# EAGLE schematic Main BoardV4 (EAGLE 9.1.3)
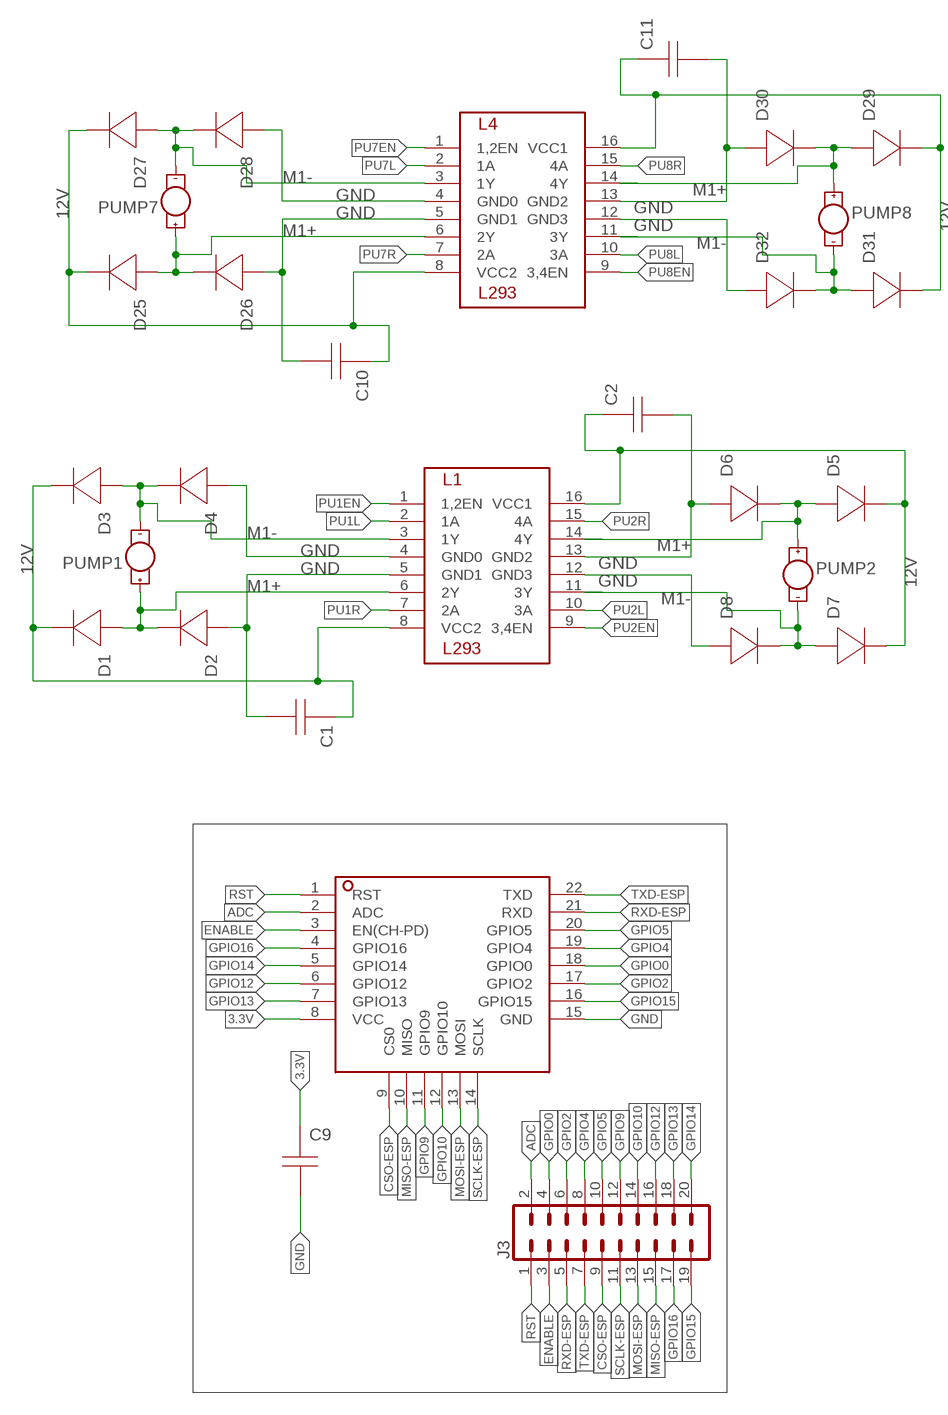
[diagram p0: schematic, sheet 1, part 1 of 2]
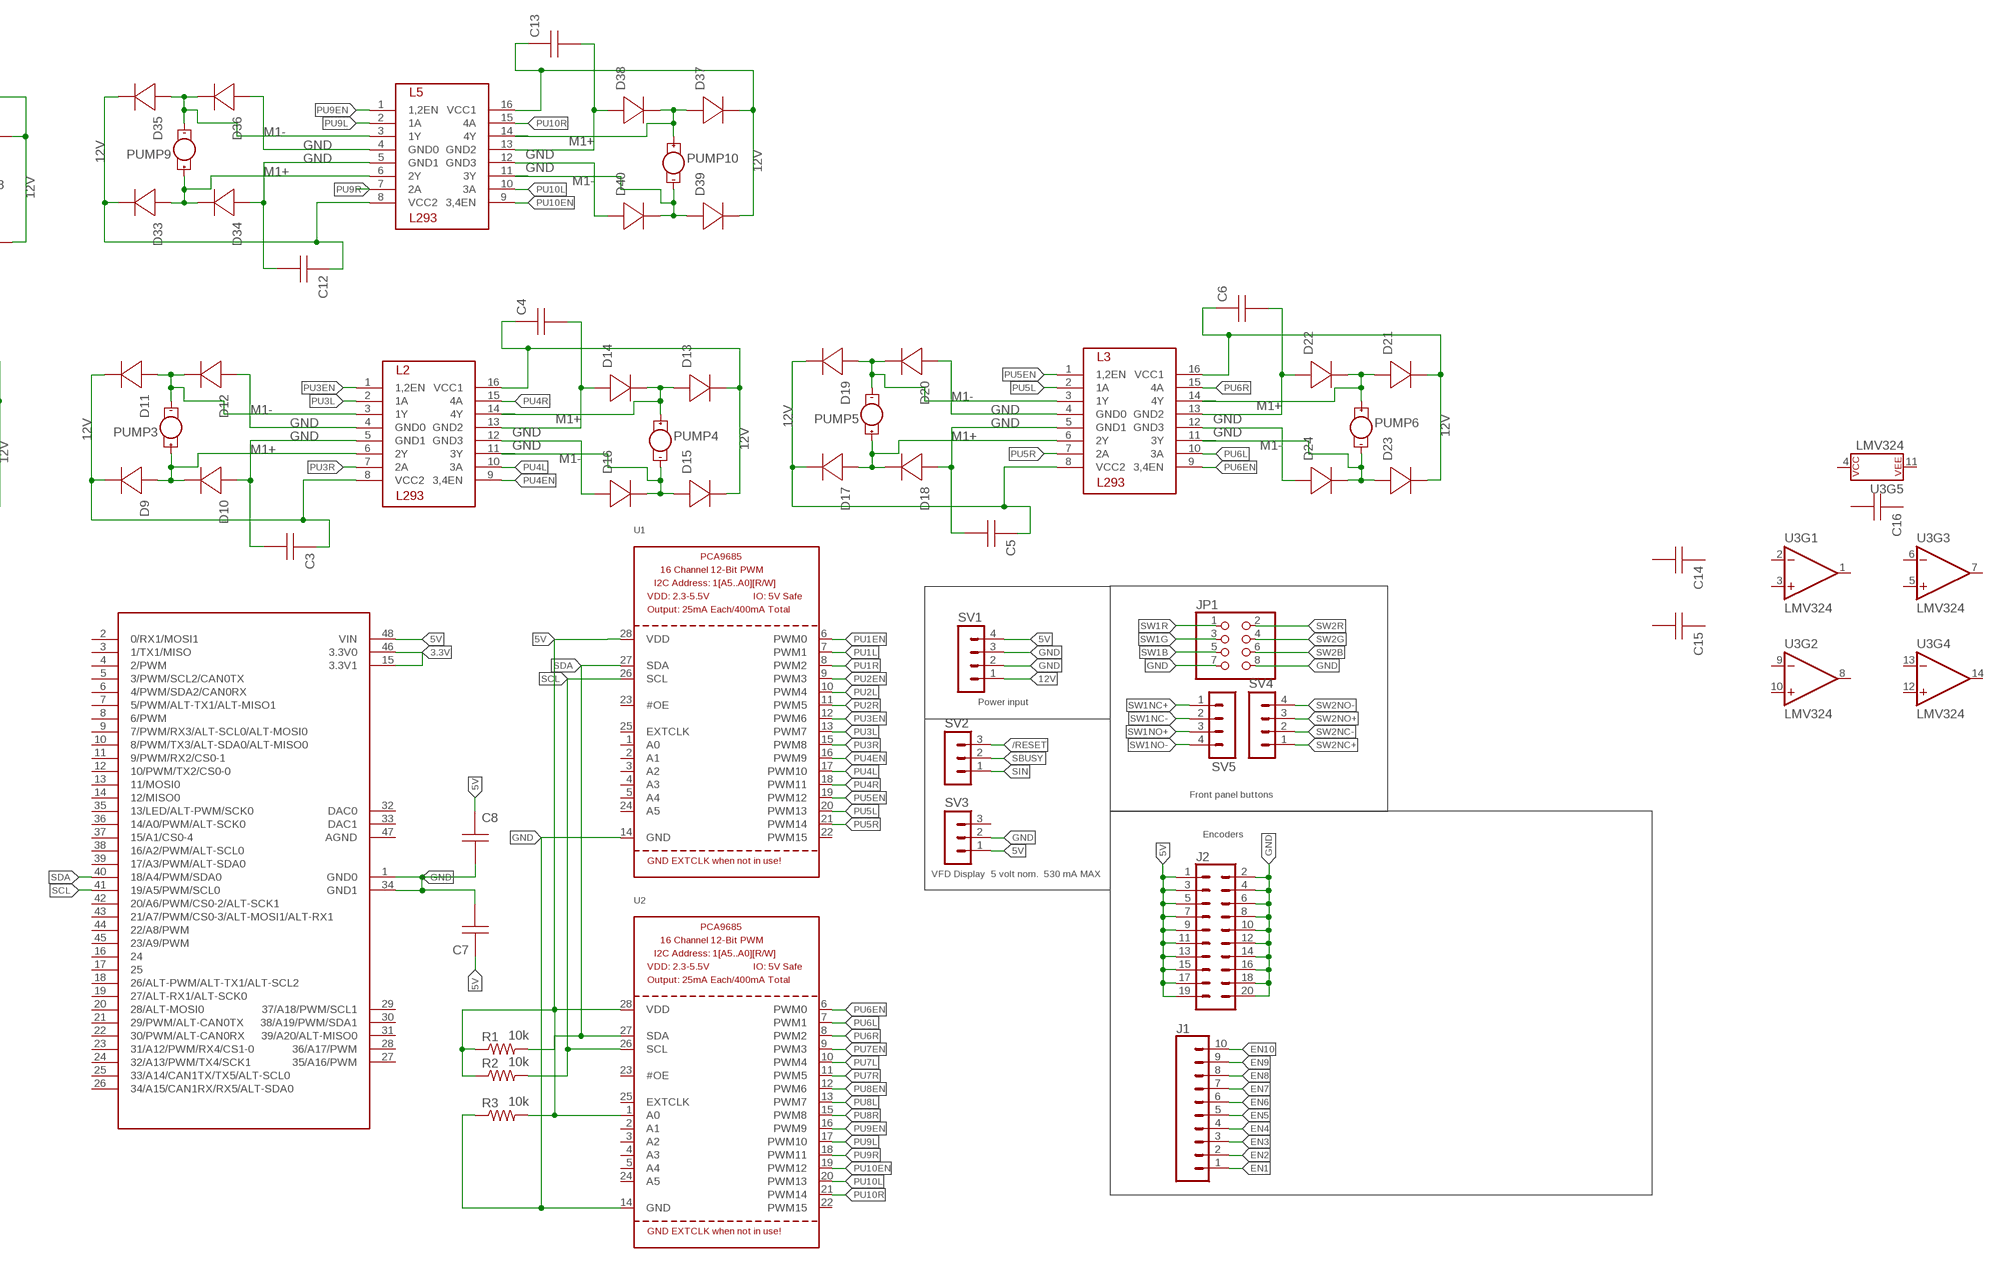
[diagram p1: schematic, sheet 1, part 2 of 2]

## Parts
C1  CAP  [C0805]
C2  CAP  [C0805]
C3  CAP  [C0805]
C4  CAP  [C0805]
C5  CAP  [C0805]
C6  CAP  [C0805]
C7  CAP  [C0805]
C8  CAP  [C0805]
C9  CAP  [C0805]
C10  CAP  [C0805]
C11  CAP  [C0805]
C12  CAP  [C0805]
C13  CAP  [C0805]
C14  CAP  [C0805]
C15  CAP  [C0805]
C16  CAP  [C0805]
D1  UPR5E3-DIODE  [DIOC4519X114]
D2  UPR5E3-DIODE  [DIOC4519X114]
D3  UPR5E3-DIODE  [DIOC4519X114]
D4  UPR5E3-DIODE  [DIOC4519X114]
D5  UPR5E3-DIODE  [DIOC4519X114]
D6  UPR5E3-DIODE  [DIOC4519X114]
D7  UPR5E3-DIODE  [DIOC4519X114]
D8  UPR5E3-DIODE  [DIOC4519X114]
D9  UPR5E3-DIODE  [DIOC4519X114]
D10  UPR5E3-DIODE  [DIOC4519X114]
D11  UPR5E3-DIODE  [DIOC4519X114]
D12  UPR5E3-DIODE  [DIOC4519X114]
D13  UPR5E3-DIODE  [DIOC4519X114]
D14  UPR5E3-DIODE  [DIOC4519X114]
D15  UPR5E3-DIODE  [DIOC4519X114]
D16  UPR5E3-DIODE  [DIOC4519X114]
D17  UPR5E3-DIODE  [DIOC4519X114]
D18  UPR5E3-DIODE  [DIOC4519X114]
D19  UPR5E3-DIODE  [DIOC4519X114]
D20  UPR5E3-DIODE  [DIOC4519X114]
D21  UPR5E3-DIODE  [DIOC4519X114]
D22  UPR5E3-DIODE  [DIOC4519X114]
D23  UPR5E3-DIODE  [DIOC4519X114]
D24  UPR5E3-DIODE  [DIOC4519X114]
D25  UPR5E3-DIODE  [DIOC4519X114]
D26  UPR5E3-DIODE  [DIOC4519X114]
D27  UPR5E3-DIODE  [DIOC4519X114]
D28  UPR5E3-DIODE  [DIOC4519X114]
D29  UPR5E3-DIODE  [DIOC4519X114]
D30  UPR5E3-DIODE  [DIOC4519X114]
D31  UPR5E3-DIODE  [DIOC4519X114]
D32  UPR5E3-DIODE  [DIOC4519X114]
D33  UPR5E3-DIODE  [DIOC4519X114]
D34  UPR5E3-DIODE  [DIOC4519X114]
D35  UPR5E3-DIODE  [DIOC4519X114]
D36  UPR5E3-DIODE  [DIOC4519X114]
D37  UPR5E3-DIODE  [DIOC4519X114]
D38  UPR5E3-DIODE  [DIOC4519X114]
D39  UPR5E3-DIODE  [DIOC4519X114]
D40  UPR5E3-DIODE  [DIOC4519X114]
ESP1  ESP8266  [ESP8266MOD]
J1  CONN_10NO_SILK_PTH_FEMALE  [1X10_NO_SILK]
J2  CONN_10X2NOSILK  [2X10_NOSILK]
J3  CONN_10X22X10_LOCK  [2X10_LOCK]
JP1  PINHD-2X4  [2X04]
L1  L293  [DIP762W53P254L1969H508Q16B]
L2  L293  [DIP762W53P254L1969H508Q16B]
L3  L293  [DIP762W53P254L1969H508Q16B]
L4  L293  [DIP762W53P254L1969H508Q16B]
L5  L293  [DIP762W53P254L1969H508Q16B]
PUMP1  PUMPS  [1X2_HEADER]
PUMP2  PUMPS  [1X2_HEADER]
PUMP3  PUMPS  [1X2_HEADER]
PUMP4  PUMPS  [1X2_HEADER]
PUMP5  PUMPS  [1X2_HEADER]
PUMP6  PUMPS  [1X2_HEADER]
PUMP7  PUMPS  [1X2_HEADER]
PUMP8  PUMPS  [1X2_HEADER]
PUMP9  PUMPS  [1X2_HEADER]
PUMP10  PUMPS  [1X2_HEADER]
R1  10k  R-US_R0402  [R0402]
R2  10k  R-US_R0402  [R0402]
R3  10k  R-US_R0402  [R0402]
SV1  MA04-1  [MA04-1]
SV2  MA03-1  [MA03-1]
SV3  MA03-1  [MA03-1]
SV4  MA04-1  [MA04-1]
SV5  MA04-1  [MA04-1]
TEENSY1  TEENSY_3.5  [DIP1524W60P254L6350H635Q48A]
U1  PCA9685  [TSSOP28]
U2  PCA9685  [TSSOP28]
U3  LMV324  [SO14]

## Nets
3.3V: C9.1(A) ESP1.8(VCC) TEENSY1.15(3.3V1) TEENSY1.46(3.3V0)
5V: C7.1(A) C8.1(A) J2.1 J2.3 J2.5 J2.7 J2.9 J2.11 J2.13 J2.15 J2.17 J2.19 R1.1 R2.1 R3.2 SV1.4 SV3.1 TEENSY1.48(VIN) U1.28(VDD) U2.1(A0) U2.28(VDD)
12V: C1.1(A) C2.1(A) C3.1(A) C4.1(A) C5.1(A) C6.1(A) C10.1(A) C11.1(A) C12.1(A) C13.1(A) D1.1(-) D3.1(-) D5.1(-) D7.1(-) D9.1(-) D11.1(-) D13.1(-) D15.1(-) D17.1(-) D19.1(-) D21.1(-) D23.1(-) D25.1(-) D27.1(-) D29.1(-) D31.1(-) D33.1(-) D35.1(-) D37.1(-) D39.1(-) L1.8(VCC2) L1.16(VCC1) L2.8(VCC2) L2.16(VCC1) L3.8(VCC2) L3.16(VCC1) L4.8(VCC2) L4.16(VCC1) L5.8(VCC2) L5.16(VCC1) SV1.1
/RESET: SV2.3
ADC: ESP1.2(ADC) J3.2
CSO-ESP: ESP1.9(CS0) J3.9
EN1: J1.1
EN2: J1.2
EN3: J1.3
EN4: J1.4
EN5: J1.5
EN6: J1.6
EN7: J1.7
EN8: J1.8
EN9: J1.9
EN10: J1.10
ENABLE: ESP1.3(EN(CH-PD)) J3.3
GND: C1.2(B) C2.2(B) C3.2(B) C4.2(B) C5.2(B) C6.2(B) C7.2(B) C8.2(B) C9.2(B) C10.2(B) C11.2(B) C12.2(B) C13.2(B) D2.2(+) D4.2(+) D6.2(+) D8.2(+) D10.2(+) D12.2(+) D14.2(+) D16.2(+) D18.2(+) D20.2(+) D22.2(+) D24.2(+) D26.2(+) D28.2(+) D30.2(+) D32.2(+) D34.2(+) D36.2(+) D38.2(+) D40.2(+) ESP1.15(GND) J2.2 J2.4 J2.6 J2.8 J2.10 J2.12 J2.14 J2.16 J2.18 J2.20 JP1.7 JP1.8 L1.4(GND0) L1.5(GND1) L1.12(GND3) L1.13(GND2) L2.4(GND0) L2.5(GND1) L2.12(GND3) L2.13(GND2) L3.4(GND0) L3.5(GND1) L3.12(GND3) L3.13(GND2) L4.4(GND0) L4.5(GND1) L4.12(GND3) L4.13(GND2) L5.4(GND0) L5.5(GND1) L5.12(GND3) L5.13(GND2) R3.1 SV1.2 SV1.3 SV3.2 TEENSY1.1(GND0) TEENSY1.34(GND1) U1.14(GND) U2.14(GND)
GPIO0: ESP1.18(GPIO0) J3.4
GPIO2: ESP1.17(GPIO2) J3.6
GPIO4: ESP1.19(GPIO4) J3.8
GPIO5: ESP1.20(GPIO5) J3.10
GPIO9: ESP1.11(GPIO9) J3.12
GPIO10: ESP1.12(GPIO10) J3.14
GPIO12: ESP1.6(GPIO12) J3.16
GPIO13: ESP1.7(GPIO13) J3.18
GPIO14: ESP1.5(GPIO14) J3.20
GPIO15: ESP1.16(GPIO15) J3.19
GPIO16: ESP1.4(GPIO16) J3.17
M1+: D1.2(+) D2.1(-) D5.2(+) D6.1(-) D9.2(+) D10.1(-) D13.2(+) D14.1(-) D17.2(+) D18.1(-) D21.2(+) D22.1(-) D25.2(+) D26.1(-) D29.2(+) D30.1(-) D33.2(+) D34.1(-) D37.2(+) D38.1(-) L1.6(2Y) L1.14(4Y) L2.6(2Y) L2.14(4Y) L3.6(2Y) L3.14(4Y) L4.6(2Y) L4.14(4Y) L5.6(2Y) L5.14(4Y) PUMP1.1(+) PUMP2.1(+) PUMP3.1(+) PUMP4.1(+) PUMP5.1(+) PUMP6.1(+) PUMP7.1(+) PUMP8.1(+) PUMP9.1(+) PUMP10.1(+)
M1-: D3.2(+) D4.1(-) D7.2(+) D8.1(-) D11.2(+) D12.1(-) D15.2(+) D16.1(-) D19.2(+) D20.1(-) D23.2(+) D24.1(-) D27.2(+) D28.1(-) D31.2(+) D32.1(-) D35.2(+) D36.1(-) D39.2(+) D40.1(-) L1.3(1Y) L1.11(3Y) L2.3(1Y) L2.11(3Y) L3.3(1Y) L3.11(3Y) L4.3(1Y) L4.11(3Y) L5.3(1Y) L5.11(3Y) PUMP1.2(-) PUMP2.2(-) PUMP3.2(-) PUMP4.2(-) PUMP5.2(-) PUMP6.2(-) PUMP7.2(-) PUMP8.2(-) PUMP9.2(-) PUMP10.2(-)
MISO-ESP: ESP1.10(MISO) J3.15
MOSI-ESP: ESP1.13(MOSI) J3.13
PU1EN: L1.1(1,2EN) U1.6(PWM0)
PU1L: L1.2(1A) U1.7(PWM1)
PU1R: L1.7(2A) U1.8(PWM2)
PU2EN: L1.9(3,4EN) U1.9(PWM3)
PU2L: L1.10(3A) U1.10(PWM4)
PU2R: L1.15(4A) U1.11(PWM5)
PU3EN: L2.1(1,2EN) U1.12(PWM6)
PU3L: L2.2(1A) U1.13(PWM7)
PU3R: L2.7(2A) U1.15(PWM8)
PU4EN: L2.9(3,4EN) U1.16(PWM9)
PU4L: L2.10(3A) U1.17(PWM10)
PU4R: L2.15(4A) U1.18(PWM11)
PU5EN: L3.1(1,2EN) U1.19(PWM12)
PU5L: L3.2(1A) U1.20(PWM13)
PU5R: L3.7(2A) U1.21(PWM14)
PU6EN: L3.9(3,4EN) U2.6(PWM0)
PU6L: L3.10(3A) U2.7(PWM1)
PU6R: L3.15(4A) U2.8(PWM2)
PU7EN: L4.1(1,2EN) U2.9(PWM3)
PU7L: L4.2(1A) U2.10(PWM4)
PU7R: L4.7(2A) U2.11(PWM5)
PU8EN: L4.9(3,4EN) U2.12(PWM6)
PU8L: L4.10(3A) U2.13(PWM7)
PU8R: L4.15(4A) U2.15(PWM8)
PU9EN: L5.1(1,2EN) U2.16(PWM9)
PU9L: L5.2(1A) U2.17(PWM10)
PU9R: L5.7(2A) U2.18(PWM11)
PU10EN: L5.9(3,4EN) U2.19(PWM12)
PU10L: L5.10(3A) U2.20(PWM13)
PU10R: L5.15(4A) U2.21(PWM14)
RST: ESP1.1(RST) J3.1
RXD-ESP: ESP1.21(RXD) J3.5
SBUSY: SV2.2
SCL: R2.2 TEENSY1.41(19/A5/PWM/SCL0) U1.26(SCL) U2.26(SCL)
SCLK-ESP: ESP1.14(SCLK) J3.11
SDA: R1.2 TEENSY1.40(18/A4/PWM/SDA0) U1.27(SDA) U2.27(SDA)
SIN: SV2.1
SW1B: JP1.5
SW1G: JP1.3
SW1NC+: SV5.1
SW1NC-: SV5.2
SW1NO+: SV5.3
SW1NO-: SV5.4
SW1R: JP1.1
SW2B: JP1.6
SW2G: JP1.4
SW2NC+: SV4.1
SW2NC-: SV4.2
SW2NO+: SV4.3
SW2NO-: SV4.4
SW2R: JP1.2
TXD-ESP: ESP1.22(TXD) J3.7
Unconnected: C14.1(A) C14.2(B) C15.1(A) C15.2(B) C16.1(A) C16.2(B) SV3.3 TEENSY1.2(0/RX1/MOSI1) TEENSY1.3(1/TX1/MISO) TEENSY1.4(2/PWM) TEENSY1.5(3/PWM/SCL2/CAN0TX) TEENSY1.6(4/PWM/SDA2/CAN0RX) TEENSY1.7(5/PWM/ALT-TX1/ALT-MISO1) TEENSY1.8(6/PWM) TEENSY1.9(7/PWM/RX3/ALT-SCL0/ALT-MOSI0) TEENSY1.10(8/PWM/TX3/ALT-SDA0/ALT-MISO0) TEENSY1.11(9/PWM/RX2/CS0-1) TEENSY1.12(10/PWM/TX2/CS0-0) TEENSY1.13(11/MOSI0) TEENSY1.14(12/MISO0) TEENSY1.16 TEENSY1.17 TEENSY1.18(26/ALT-PWM/ALT-TX1/ALT-SCL2) TEENSY1.19(27/ALT-RX1/ALT-SCK0) TEENSY1.20(28/ALT-MOSI0) TEENSY1.21(29/PWM/ALT-CAN0TX) TEENSY1.22(30/PWM/ALT-CAN0RX) TEENSY1.23(31/A12/PWM/RX4/CS1-0) TEENSY1.24(32/A13/PWM/TX4/SCK1) TEENSY1.25(33/A14/CAN1TX/TX5/ALT-SCL0) TEENSY1.26(34/A15/CAN1RX/RX5/ALT-SDA0) TEENSY1.27(35/A16/PWM) TEENSY1.28(36/A17/PWM) TEENSY1.29(37/A18/PWM/SCL1) TEENSY1.30(38/A19/PWM/SDA1) TEENSY1.31(39/A20/ALT-MISO0) TEENSY1.32(DAC0) TEENSY1.33(DAC1) TEENSY1.35(13/LED/ALT-PWM/SCK0) TEENSY1.36(14/A0/PWM/ALT-SCK0) TEENSY1.37(15/A1/CS0-4) TEENSY1.38(16/A2/PWM/ALT-SCL0) TEENSY1.39(17/A3/PWM/ALT-SDA0) TEENSY1.42(20/A6/PWM/CS0-2/ALT-SCK1) TEENSY1.43(21/A7/PWM/CS0-3/ALT-MOSI1/ALT-RX1) TEENSY1.44(22/A8/PWM) TEENSY1.45(23/A9/PWM) TEENSY1.47(AGND) U1.1(A0) U1.2(A1) U1.3(A2) U1.4(A3) U1.5(A4) U1.22(PWM15) U1.23(#OE) U1.24(A5) U1.25(EXTCLK) U2.2(A1) U2.3(A2) U2.4(A3) U2.5(A4) U2.22(PWM15) U2.23(#OE) U2.24(A5) U2.25(EXTCLK) U3.1(OUT) U3.2(-IN) U3.3(+IN) U3.4(P$V+) U3.5(+IN) U3.6(-IN) U3.7(OUT) U3.8(OUT) U3.9(-IN) U3.10(+IN) U3.11(P$V-) U3.12(+IN) U3.13(-IN) U3.14(OUT)

## Notes on the sheet
- Power input
- Front panel buttons
- Encoders
- VFD Display | 5 volt nom. | 530 mA MAX

## Library data of the parts
C1-C16 = sym:CAP: Capacitor
D1-D40 = EPR5E3-Diode:UPR5E3-DIODE
ESP1 = ESP8266:ESP8266
J1 = SparkFun-Connectors:CONN_10: Multi connection point. Often used as Generic Header-pin footprint for 0.1 inch spaced/style header connections On any of the 0.1 inch spaced packages, you can populate with these: Break Away Headers - Straight <https://www.sparkfun.com/products/116> (PRT-00116) Break Away Male Headers - Right Angle <https://www.sparkfun.com/products/553> (PRT-00553) Female Headers <https://www.sparkfun.com/products/115> (PRT-00115) Break Away Headers - Machine Pin <https://www.sparkfun.com/products/117> (PRT-00117) Break Away Female Headers - Swiss Machine Pin <https://www.sparkfun.com/products/743> (PRT-00743) Arduino Stackable Header - 10 Pin <https://www.sparkfun.com/products/11376> (PRT-11376) For SCREWTERMINALS and SPRING TERMINALS visit here: Screw Terimnals on SparkFun.com <https://www.sparkfun.com/search/results?term=Screw+Terminals> (5mm/3.5mm/2.54mm spacing) This device is also useful as a general connection point to wire up your design to another part of your project. Our various solder wires solder well into these plated through hole pads. Hook-Up Wire - Assortment (Stranded, 22 AWG) <https://www.sparkfun.com/products/11375> (PRT-11375) Hook-Up Wire - Assortment (Solid Core, 22 AWG) <https://www.sparkfun.com/products/11367> (PRT-11367) View the entire wire category on our website here <https://www.sparkfun.com/categories/141> Special notes: Molex polarized connector foot print use with SKU : PRT-08231 with associated crimp pins and housings. 1MM SMD Version SKU: PRT-10208 NOTES ON THE VARIANTS LOCK and LOCK_LONGPADS... This footprint was designed to help hold the alignment of a through-hole component (i.e. 6-pin header) while soldering it into place. You may notice that each hole has been shifted either up or down by 0.005 of an inch from it's more standard position (which is a perfectly straight line). This slight alteration caused the pins (the squares in the middle) to touch the edges of the holes. Because they are alternating, it causes a "brace" to hold the component in place. 0.005 has proven to be the perfect amount of "off-center" position when using our standard breakaway headers. Although looks a little odd when you look at the bare footprint, once you have a header in there, the alteration is very hard to notice. Also,if you push a header all the way into place, it is covered up entirely on the bottom side.; PROD_ID: CONN-11563
J2 J3 = SparkFun-Connectors:CONN_10X2: Multi connection point. Often used as Generic Header-pin footprint for 0.1 inch spaced/style header connections On any of the 0.1 inch spaced packages, you can populate with these: Break Away Headers - Straight <https://www.sparkfun.com/products/116> (PRT-00116) Break Away Male Headers - Right Angle <https://www.sparkfun.com/products/553> (PRT-00553) Female Headers <https://www.sparkfun.com/products/115> (PRT-00115) Break Away Headers - Machine Pin <https://www.sparkfun.com/products/117> (PRT-00117) Break Away Female Headers - Swiss Machine Pin <https://www.sparkfun.com/products/743> (PRT-00743) Special note about the "SPECIAL" package: This was SPECIALLY designed to be used with our Graphic LCD Backpack. Be sure you want to use this! It is not only staggered on each line of header holes, but IT IS ALSO offset of the center point of the top and bottom lines by 5 mil. This causes the headers to lock into place on the "standard" footprint on the LCD screen. The extra squares on the tdocu layer are there simply to reference other pins (if you were to actually populate a longer header than ten long - this is what we do with the backpacks).
JP1 = adafruit:PINHD-2X4: PIN HEADER
L1-L5 = L293:L293
PUMP1-PUMP10 = Peristaltic pump:PUMP
R1-R3 = adafruit:R-US_: RESISTOR, American symbol
SV1 SV4 SV5 = con-lstb:MA04-1: PIN HEADER; OC_FARNELL: unknown; OC_NEWARK: unknown
SV2 SV3 = con-lstb:MA03-1: PIN HEADER; OC_FARNELL: unknown; OC_NEWARK: unknown
TEENSY1 = Teensy_3.5:TEENSY_3.5
U1 U2 = adafruit:PCA9685: PCA9685 - 16 Channel 12-Bit I2C PWM Controller 5.0V tolerant 16 channel, 12-bit I2C PWM controller with 25mA per output (max. 400mA total) Digikey: 568-5931-1-ND
U3 = SparkFun-IC-Amplifiers:LMV324: IC LMV324 Quad Op Amp Jellybean quad op-amp Datasheet <http://cdn.sparkfun.com/datasheets/Sensors/Sound/LMV324.pdf> SparkFun Products SparkFun Sensor Kit <https://www.sparkfun.com/products/13754> (DEV-13754) SparkFun Inventor's Kit for Arduino 101 <https://www.sparkfun.com/products/13844> (KIT-13844) SparkFun Sound Detector <https://www.sparkfun.com/products/12642> (SEN-12642); PROD_ID: IC-08227

## Net classes
1 Motor: width 0.782 mm, drill 0.6 mm, clearance 0.152 mm